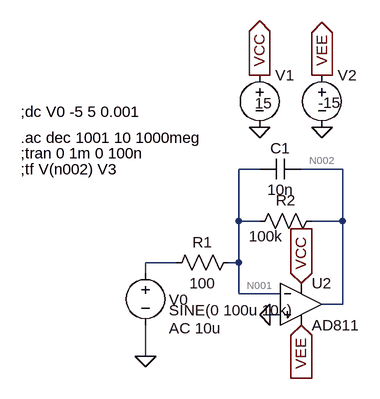
[diagram p0: schematic InvertingAmp.asc]
InvertingAmp.asc, the LTspice schematic file:
Version 4
SHEET 1 1048 680
WIRE 224 48 192 48
WIRE 352 48 288 48
WIRE 192 128 192 48
WIRE 224 128 192 128
WIRE 352 128 352 48
WIRE 352 128 304 128
WIRE 96 192 48 192
WIRE 192 192 192 128
WIRE 192 192 176 192
WIRE 48 208 48 192
WIRE 192 240 192 192
WIRE 256 240 192 240
WIRE 352 256 352 128
WIRE 352 256 320 256
WIRE 256 272 240 272
WIRE 48 336 48 288
FLAG 48 336 0
FLAG 240 272 0
FLAG 224 -16 0
FLAG 320 -16 0
FLAG 224 -96 VCC
IOPIN 224 -96 Out
FLAG 320 -96 VEE
IOPIN 320 -96 Out
FLAG 288 224 VCC
IOPIN 288 224 In
FLAG 288 288 VEE
IOPIN 288 288 In
SYMBOL res 192 176 R90
WINDOW 0 0 56 VBottom 2
WINDOW 3 32 56 VTop 2
SYMATTR InstName R1
SYMATTR Value 100
SYMBOL res 320 112 R90
WINDOW 0 0 56 VBottom 2
WINDOW 3 24 86 VTop 2
SYMATTR InstName R2
SYMATTR Value 100k
SYMBOL voltage 224 -112 R0
WINDOW 123 0 0 Left 2
WINDOW 39 0 0 Left 2
WINDOW 3 -7 59 Left 2
SYMATTR Value 15
SYMATTR InstName V1
SYMBOL voltage 320 -112 R0
WINDOW 123 0 0 Left 2
WINDOW 39 0 0 Left 2
WINDOW 3 -6 58 Left 2
SYMATTR Value -15
SYMATTR InstName V2
SYMBOL voltage 48 192 R0
WINDOW 0 36 57 Left 2
WINDOW 3 36 73 Left 2
WINDOW 123 36 101 Left 2
WINDOW 39 0 0 Left 2
SYMATTR InstName V0
SYMATTR Value SINE(0 100u 10k)
SYMATTR Value2 AC 10u
SYMBOL Opamps\\AD811 288 192 R0
SYMATTR InstName U2
SYMBOL cap 288 32 R90
WINDOW 0 0 32 VBottom 2
WINDOW 3 32 32 VTop 2
SYMATTR InstName C1
SYMATTR Value 10n
TEXT -144 24 Left 2 !;tran 0 1m 0 100n
TEXT -144 48 Left 2 !;tf V(n002) V3
TEXT -144 0 Left 2 !.ac dec 1001 10 1000meg
TEXT -144 -40 Left 2 !;dc V0 -5 5 0.001

The netlist it stands for:
* InvertingAmp.asc
R1 N001 N003 100
R2 N002 N001 100k
V1 VCC 0 15
V2 VEE 0 -15
V0 N003 0 SINE(0 100u 10k) AC 10u
XU2 0 N001 VCC VEE N002 AD811  ; pins In+ In- V+ V- OUT
C1 N002 N001 10n
;tran 0 1m 0 100n
;tf V(n002) V3
.ac dec 1001 10 1000meg
;dc V0 -5 5 0.001
.backanno
.end

* Results of the author's LTspice run, read from the files saved beside the schematic
* Operating Point, zero values left out:
*   V(n001) = 497.4 µV
*   V(n002) = 279.3 mV
*   V(vcc) = 15 V
*   V(vee) = -15 V
*   I(R2) = 2.788 µA
*   I(R1) = 4.974 µA
*   I(V0) = 4.974 µA
*   I(V2) = 17.51 mA
*   I(V1) = -17.51 mA
*   Ix(u2:1) = -2 µA
*   Ix(u2:2) = -2.186 µA
*   Ix(u2:99) = 17.51 mA
*   Ix(u2:50) = -17.51 mA
*   Ix(u2:28) = -2.788 µA
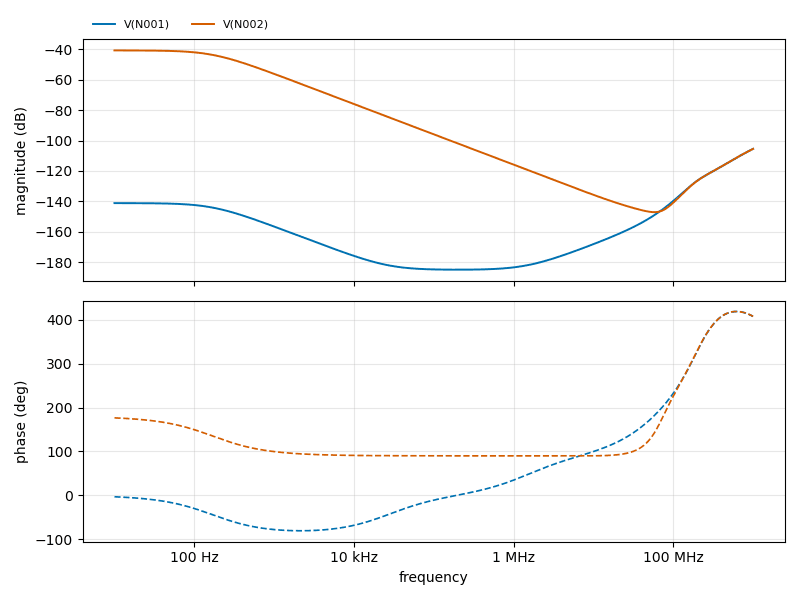
[diagram p1: AC Analysis of InvertingAmp.asc, plotted from the saved traces]
* AC Analysis, 1 run:
*   V(N001): -141.21 dB at 10 Hz, -105.50 dB at 1 GHz, peak -105.50 dB at 1 GHz, 3 dB below the peak at 775.5 MHz
*   V(N002): -40.65 dB at 10 Hz, -105.50 dB at 1 GHz, peak -40.65 dB at 10 Hz, 3 dB below the peak at 171.8 Hz